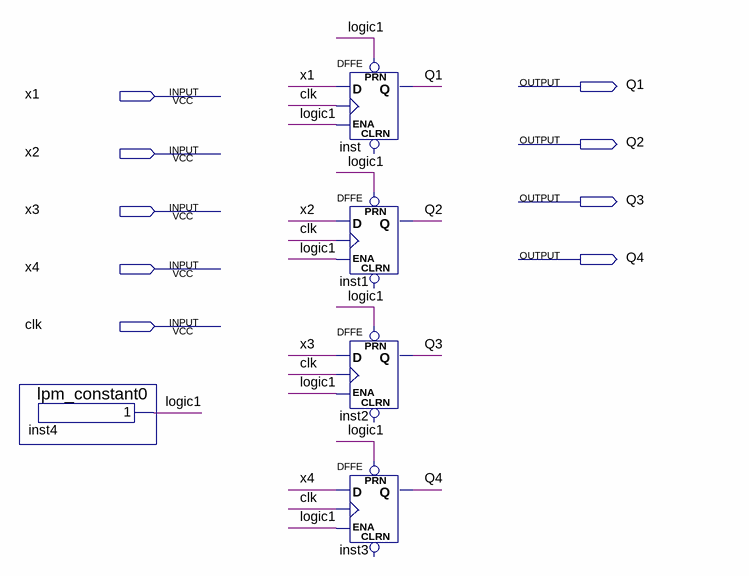
[diagram p0: schematic sheet]
// Quartus schematic lab5.bdf as structural Verilog: 5 symbols, 9 pins
module lab5 (
  input  x1,
  input  x2,
  input  x3,
  input  x4,
  input  clk,
  output Q1,
  output Q2,
  output Q3,
  output Q4
);

  wire logic1;

  lpm_constant0 inst4 (.result(logic1));
  DFFE inst (.PRN(logic1), .D(x1), .CLK(clk), .ENA(logic1), .Q(Q1));  // open: CLRN
  DFFE inst1 (.PRN(logic1), .D(x2), .CLK(clk), .ENA(logic1), .Q(Q2));  // open: CLRN
  DFFE inst2 (.PRN(logic1), .D(x3), .CLK(clk), .ENA(logic1), .Q(Q3));  // open: CLRN
  DFFE inst3 (.PRN(logic1), .D(x4), .CLK(clk), .ENA(logic1), .Q(Q4));  // open: CLRN
endmodule
